# Altium schematic sheet SPL1301 for Cal V1.0.SchDoc
size A4
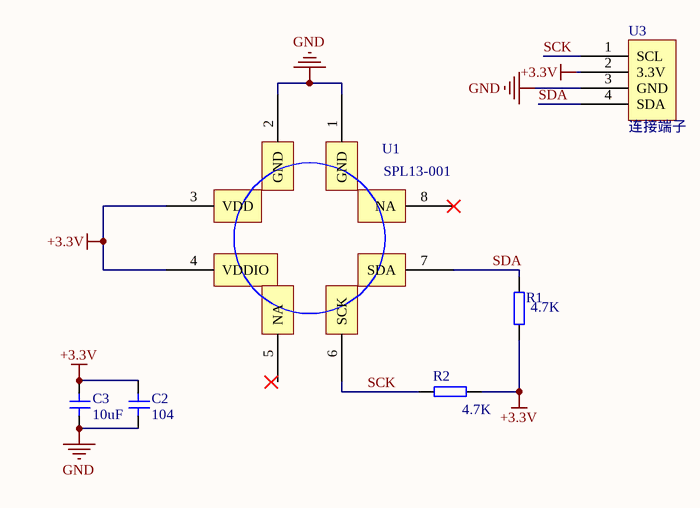
[diagram p0: SPL1301 for Cal V1.0.SchDoc]

## Parts
C2  104  [0603C]
C3  10uF  [0603C]
R1  4.7K  [0603R]
R2  4.7K  [0603R]
U1  SPL13-001  [SPL13-001]
U3  连接端子  [连接端子]

## Nets
+3.3V: C2.2 C3.2 R1.1 R2.1 U1.3(VDD) U1.4(VDDIO) U3.2(3.3V)
GND: C2.1 C3.1 U1.1(GND) U1.2(GND) U3.3(GND)
SCK: R2.2 U1.6(SCK) U3.1(SCL)
SDA: R1.2 U1.7(SDA) U3.4(SDA)

Not connected (* = marked no-connect by the designer): U1 5(NA) 8(NA)*

## Library data of the parts
C2 C3 = Cap1: 无极贴片电容
R1 R2 = Res: 电阻
U1 = SPL13-001_1